# EAGLE design terrain_twister_interposer (EAGLE 8.2.1)
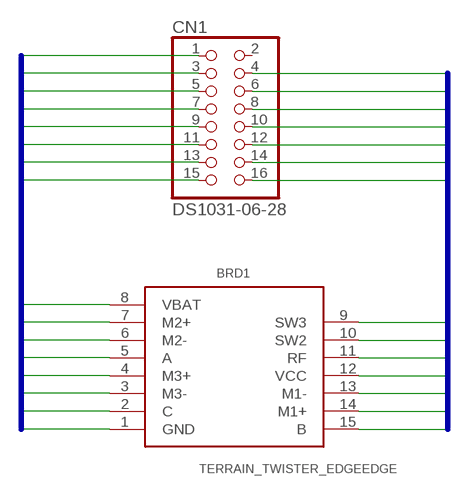
[diagram p0: schematic, sheet 1]

## Parts
BRD1  TERRAIN_TWISTER_EDGEEDGE  [TERRAIN_TWISTER_CONTROL_BRD_EDGE]
CN1  DS1031-06-28  [1296-16]

## Nets
B1: BRD1.1(GND) CN1.15
B2: BRD1.2(C) CN1.13
B3: BRD1.3(M3-) CN1.11
B4: BRD1.4(M3+) CN1.9
B5: BRD1.5(A) CN1.7
B6: BRD1.6(M2-) CN1.5
B7: BRD1.7(M2+) CN1.3
B8: BRD1.8(VBAT) CN1.1
BUS9: BRD1.9(SW3) CN1.4
BUS10: BRD1.10(SW2) CN1.6
BUS11: BRD1.11(RF) CN1.8
BUS12: BRD1.12(VCC) CN1.10
BUS13: BRD1.13(M1-) CN1.12
BUS14: BRD1.14(M1+) CN1.14
BUS15: BRD1.15(B) CN1.16
Unconnected: CN1.2

## Buses
B[1..8]
BUS[9..15]

## Library data of the parts
BRD1 = terrain_twister_control_board_edge:TERRAIN_TWISTER_EDGE
CN1 = DS1031-06-xx:DS1031-06-2*8

## Board
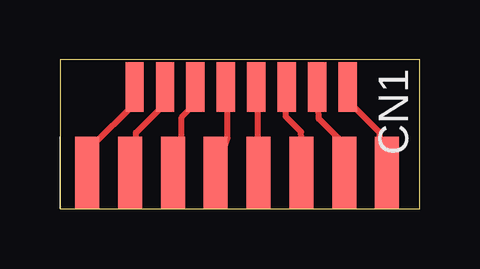
[diagram p1: board, top side]
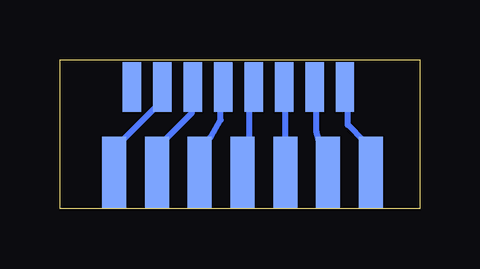
[diagram p2: board, bottom side, seen from below]

Size 15 x 6.2 mm. Coordinates in mm from the lower left corner, seen from the top.
Outline: 0,0 15,0 15,6.2 0,6.2 0,0
Copper layers (1*16): Top 0.035mm / dielectric 1.5mm / Bottom 0.035mm
Design rules "dirt_cheap_dirty_boards.v1 *": minimum track width 10mil, minimum drill 0.3mm, track to track 6mil, track to pad 6mil, pad to pad 6mil, via to via 6mil, smd to smd 0mil, copper to edge 10mil, drill to drill 10mil, minimum pad ring 10mil, minimum via ring 6mil, stop-mask expansion 2mil, vias tented up to drill 25mil, thermal gap 10mil

### Footprints (pad centres in the part's own frame; a part is rotated, then mirrored left to right if it is on the bottom)
TERRAIN_TWISTER_CONTROL_BRD_EDGE = smd 1 x 3: 1 1.143,1.5; 2 2.929,1.5; 3 4.714,1.5; 4 6.5,1.5; 5 8.286,1.5; 6 10.071,1.5; 7 11.857,1.5; 8 13.643,1.5 | smd 1 x 3 bottom: 9 12.743,1.5; 10 10.957,1.5; 11 9.171,1.5; 12 7.386,1.5; 13 5.6,1.5; 14 3.814,1.5; 15 2.029,1.5
1296-16 = smd 0.76 x 2.05: 1 0,0.125; 3 1.27,0.125; 5 2.54,0.125; 7 3.81,0.125; 9 5.08,0.125; 11 6.35,0.125; 13 7.62,0.125; 15 8.89,0.125 | smd 0.76 x 2.05 bottom: 2 0,0.125; 4 1.27,0.125; 6 2.54,0.125; 8 3.81,0.125; 10 5.08,0.125; 12 6.35,0.125; 14 7.62,0.125; 16 8.89,0.125

### Placement (x,y rotation side)
BRD1  0,0 0 top
CN1  12,5.2 180 top

### Tracks (layer width: path | path; a pad name or v marks a point on that pad's centre or on a via)
B1
  Top 0.254: CN1.15 3.17,4.45 1.27,2.54 1.27,1.91 BRD1.1
B2
  Top 0.254: CN1.13 4.45,4.45 3.17,3.17 3.17,1.91 BRD1.2
B3
  Top 0.254: CN1.11 5.71,4.45 5.08,3.81 5.08,1.91 BRD1.3
B4
  Top 0.254: CN1.9 6.99,4.45 6.99,3 BRD1.4
B5
  Top 0.254: CN1.7 8.26,4.45 8.26,1.91 BRD1.5
B6
  Top 0.254: CN1.5 9.43,3.85 10.06,3.21 10.16,1.91 BRD1.6
B7
  Top 0.254: CN1.3 10.79,3.75 11.63,2.91 11.63,1.71 BRD1.7
B8
  Top 0.254: CN1.1 12.06,4.45 13.34,3.17 13.34,1.91 BRD1.8
BUS9
  Bottom 0.254: CN1.4 10.79,4.45 12.7,2.54 12.7,1.91 BRD1.9
BUS10
  Bottom 0.254: CN1.6 9.5,4.5 9.5,4 10.7,2.8 10.7,1.3 BRD1.10
BUS11
  Bottom 0.254: BRD1.11 9.17,2.53 8.7,3 8.3,3.7 8.3,5.1 CN1.8
BUS12
  Bottom 0.254: CN1.10 7.1,4.5 7.1,1.5 BRD1.12
BUS13
  Bottom 0.254: BRD1.13 5.6,4.5 CN1.12
BUS14
  Bottom 0.254: BRD1.14 4.3,3.2 4.3,4.3 CN1.14
BUS15
  Bottom 0.254: CN1.16 3,4.5 3,3.5 2.3,2.8 2.3,1.3 BRD1.15